# EAGLE design OBDShield_1_1+ (EAGLE 7.1.0)
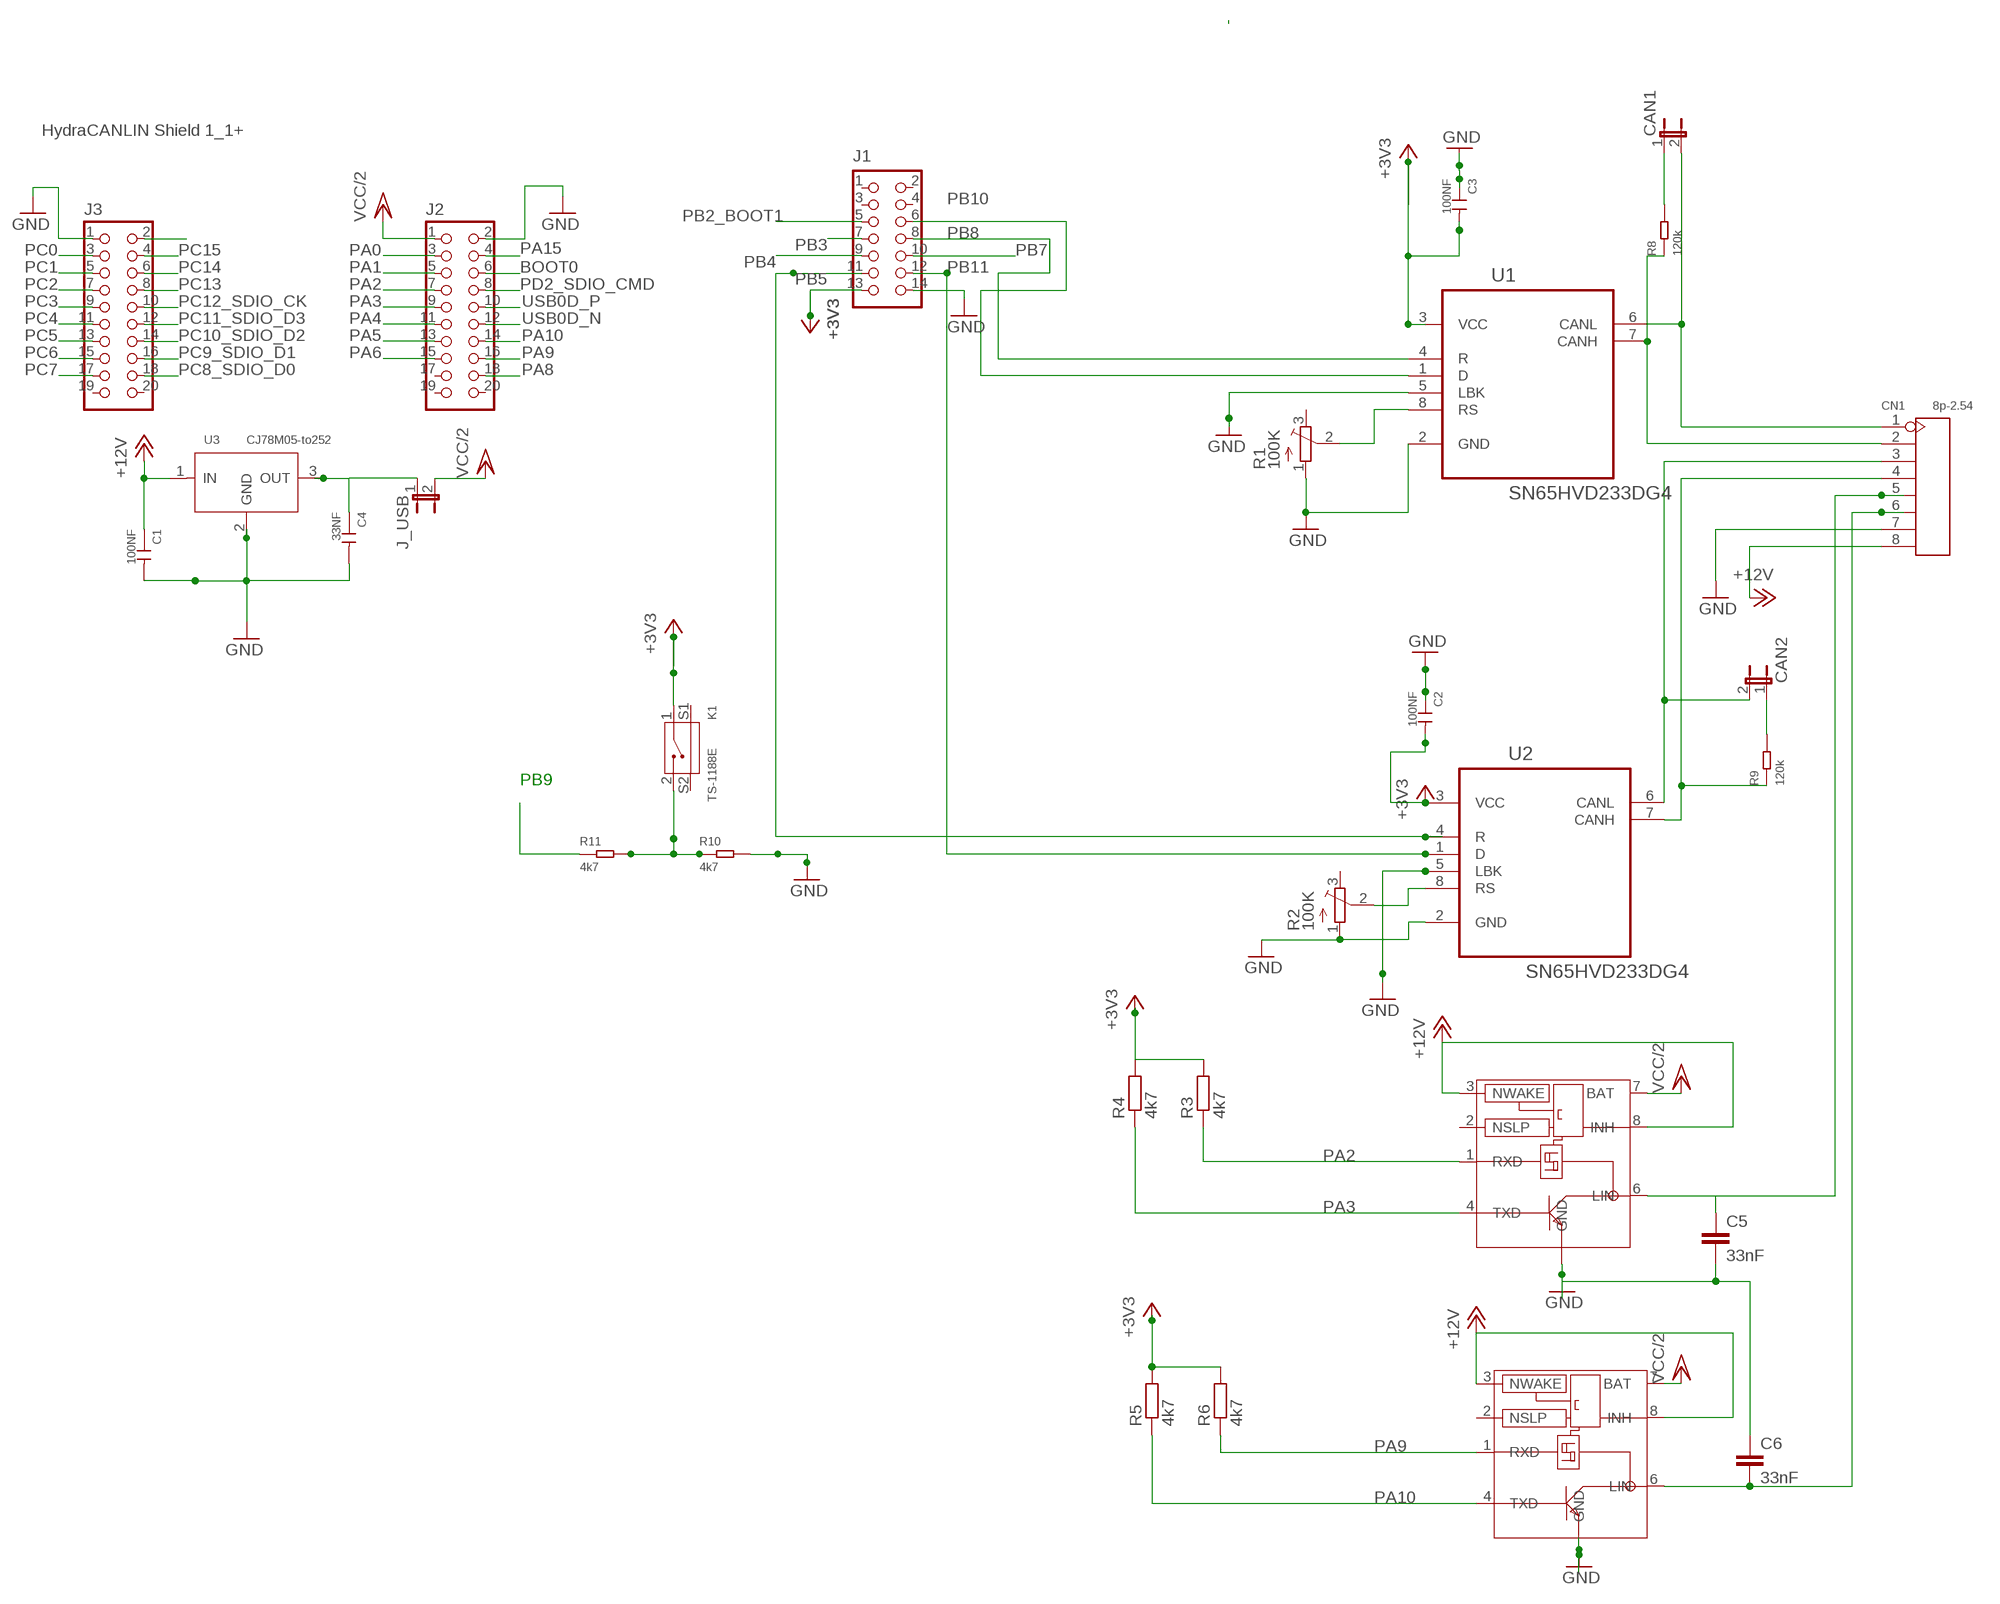
[diagram p0: schematic, sheet 1]

## Parts
C1  100NF  CERAMIC-100NF-50V-20%-Y5V(0805)  [C0805]
C2  100NF  CERAMIC-100NF-50V-20%-Y5V(0805)  [C0805]
C3  100NF  CERAMIC-100NF-50V-20%-Y5V(0805)  [C0805]
C4  33NF  CERAMIC-100NF-50V-20%-Y5V(0805)  [C0805]
C5  33nF  CAP1206  [1206]
C6  33nF  CAP1206  [1206]
CAN1  JP1E  [JP1]
CAN2  JP1E  [JP1]
CN1  8p-2.54  DIP-BLACK-FEMALE-HEADER-VERT(8P-2.54)  [H8-2.54]
J1  HYDRABUS_SHIELD_CON_HEADER_2X07  [HYDRABUS_SHIELD_M2X7]
J2  HYDRABUS_SHIELD_CON_HEADER_2X10  [HYDRABUS_SHIELD_M2X10]
J3  HYDRABUS_SHIELD_CON_HEADER_2X10  [HYDRABUS_SHIELD_M2X10]
J_USB  JP1E  [JP1]
K1  TS-1188E  SMD-BUTTON-2+2P  [SW4-SMD-7.0X3.5X3.5MM-90D]
LIN1  TJA1020SO8  [SO8]
LIN2  TJA1020SO8  [SO8]
R1  100K  TRIM_EU-SM-42/43A  [SM-42/43A]
R2  100K  TRIM_EU-SM-42/43A  [SM-42/43A]
R3  4k7  R-EU_M1206  [M1206]
R4  4k7  R-EU_M1206  [M1206]
R5  4k7  R-EU_M1206  [M1206]
R6  4k7  R-EU_M1206  [M1206]
R8  120k  SMD-RES-33K-1%-1/4W(1206)  [R1206]
R9  120k  SMD-RES-33K-1%-1/4W(1206)  [R1206]
R10  4k7  SMD-RES-33K-1%-1/4W(1206)  [R1206]
R11  4k7  SMD-RES-33K-1%-1/4W(1206)  [R1206]
U1  SN65HVD233DG4  [SOIC127P600X175-8N]
U2  SN65HVD233DG4  [SOIC127P600X175-8N]
U3  CJ78M05-to252  PMIC-CJ78M05(TO-252)  [TO-252]

## Nets
+3V3 [VDD]: C2.2 C3.2 J1.13 K1.1 R3.2 R4.2 R5.2 R6.2 U1.3(VCC) U2.3(VCC)
+12V [VDD]: C1.1 CN1.8 LIN1.3(NWAKE) LIN1.8(INH) LIN2.3(NWAKE) LIN2.8(INH) U3.1(IN)
BOOT0: J2.6
GND [VDD]: C1.2 C2.1 C3.1 C4.2 C5.2 C6.1 CN1.7 J1.14 J2.2 J3.1 LIN1.5(GND) LIN2.5(GND) R1.1(A) R2.1(A) R10.2 U1.2(GND) U1.5(LBK) U2.2(GND) U2.5(LBK) U3.2(GND)
N$1: R1.2(S) U1.8(RS)
N$4: C5.1 CN1.5 LIN2.6(LIN)
N$7: C6.2 CN1.6 LIN1.6(LIN)
N$9: CAN1.2 CN1.1 U1.6(CANL)
N$10: CN1.2 R8.1 U1.7(CANH)
N$11: CAN2.2 CN1.3 U2.6(CANL)
N$12: CN1.4 R9.1 U2.7(CANH)
N$15 [VDD]: C4.1 J_USB.1 U3.3(OUT)
N$16: CAN2.1 R9.2
N$17: R2.2(S) U2.8(RS)
N$19: CAN1.1 R8.2
N$21: K1.2 R10.1 R11.2
N$22 [POWER]: J3.2
PA0: J2.3
PA1: J2.5
PA2: J2.7 LIN2.1(RXD) R3.1
PA3: J2.9 LIN2.4(TXD) R4.1
PA4: J2.11
PA5: J2.13
PA6: J2.15
PA8: J2.18
PA9: J2.16 LIN1.1(RXD) R6.1
PA10: J2.14 LIN1.4(TXD) R5.1
PA15: J2.4
PB2_BOOT1: J1.5
PB3: J1.7
PB4: J1.9
PB5: J1.11 U2.4(R)
PB7: J1.10 R11.1
PB8: J1.8 U1.4(R)
PB10: J1.6 U1.1(D)
PB11: J1.12 U2.1(D)
PC0: J3.3
PC1: J3.5
PC2: J3.7
PC3: J3.9
PC4: J3.11
PC5: J3.13
PC6: J3.15
PC7: J3.17
PC8_SDIO_D0: J3.18
PC9_SDIO_D1: J3.16
PC10_SDIO_D2: J3.14
PC11_SDIO_D3: J3.12
PC12_SDIO_CK: J3.10
PC13: J3.8
PC14: J3.6
PC15: J3.4
PD2_SDIO_CMD: J2.8
USB0D_N: J2.12
USB0D_P: J2.10
VCC/2 [VDD]: J2.1 J_USB.2 LIN1.7(BAT) LIN2.7(BAT)
Unconnected: J1.1 J1.2 J1.3 J1.4 J2.17 J2.19 J2.20 J3.19 J3.20 K1.S1 K1.S2 LIN1.2(NSLP) LIN2.2(NSLP) R1.3(E) R2.3(E)

## Notes on the sheet
- HydraCANLIN Shield 1_1+
- PB9

## Library data of the parts
C1-C3 = Seeed-OPL-Capacitor:CERAMIC-100NF-50V-20%-Y5V(0805): 302010145
C4 = Seeed-OPL-Capacitor:CERAMIC-100NF-50V-20%-Y5V(0805): 302010145; VALUE: 100NF
C5 C6 = _c2h:CAP: Capacitor Standard 0603 ceramic capacitor, and 0.1" leaded capacitor.
CAN1 CAN2 J_USB = jumper:JP1E: JUMPER
CN1 = Seeed-OPL-Connector:DIP-BLACK-FEMALE-HEADER-VERT(8P-2.54): 320030061; MPN: F185-1108A1BSYC1
J1 = hydrabus_shield:HYDRABUS_SHIELD_CON_HEADER_2X07: 2x7 Pin header
J2 J3 = hydrabus_shield:HYDRABUS_SHIELD_CON_HEADER_2X10: 2x10 Pin header
K1 = Seeed-OPL-Button:SMD-BUTTON-2+2P: 311020023; MPN: TS-1188E
LIN1 LIN2 = nxp:TJA1020: Lin Transiver Vbat 5...27Volt 3,3Volt support no extra supply needed ->www.lin-subbus.org ->www.semiconductor.philips.com/pip/tja1020t
R1 R2 = pot:TRIM_EU-: POTENTIOMETER
R3-R6 = resistor:R-EU_: RESISTOR, European symbol
R8-R11 = Seeed-OPL-Resistor:SMD-RES-33K-1%-1/4W(1206): 301010725; MPN: RC1206FR-0733KL; VALUE: 33k
U1 U2 = Texas Instruments_By_element14_Batch_1:SN65HVD233DG4: CAN TRANSCEIVERS; MPN: SN65HVD233DG4; OC_FARNELL: 1207268; OC_NEWARK: 16M2304; PACKAGE: SOIC-8; SUPPLIER: TI
U3 = Seeed-OPL-ic:PMIC-CJ78M05(TO-252): 310030100; MPN: CJ78M05

## Net classes
0 default: width 0.254 mm, drill 0.33 mm, clearance 0.203 mm
1 POWER: width 0.254 mm, drill 0.33 mm, clearance 0.203 mm
2 VDD: width 0.33 mm, drill 0.33 mm, clearance 0.203 mm

## Board
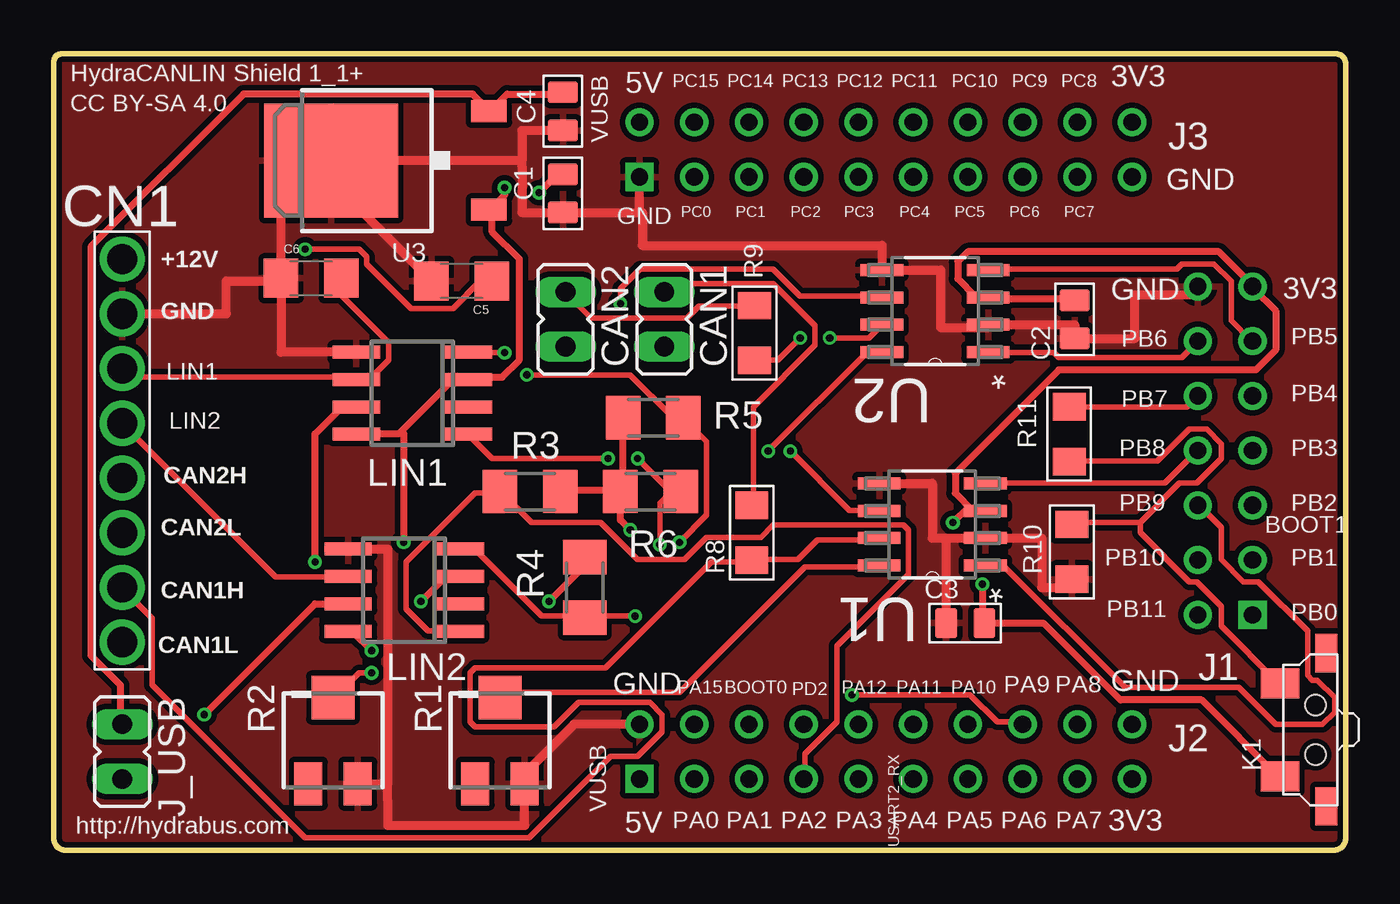
[diagram p1: board, top side]
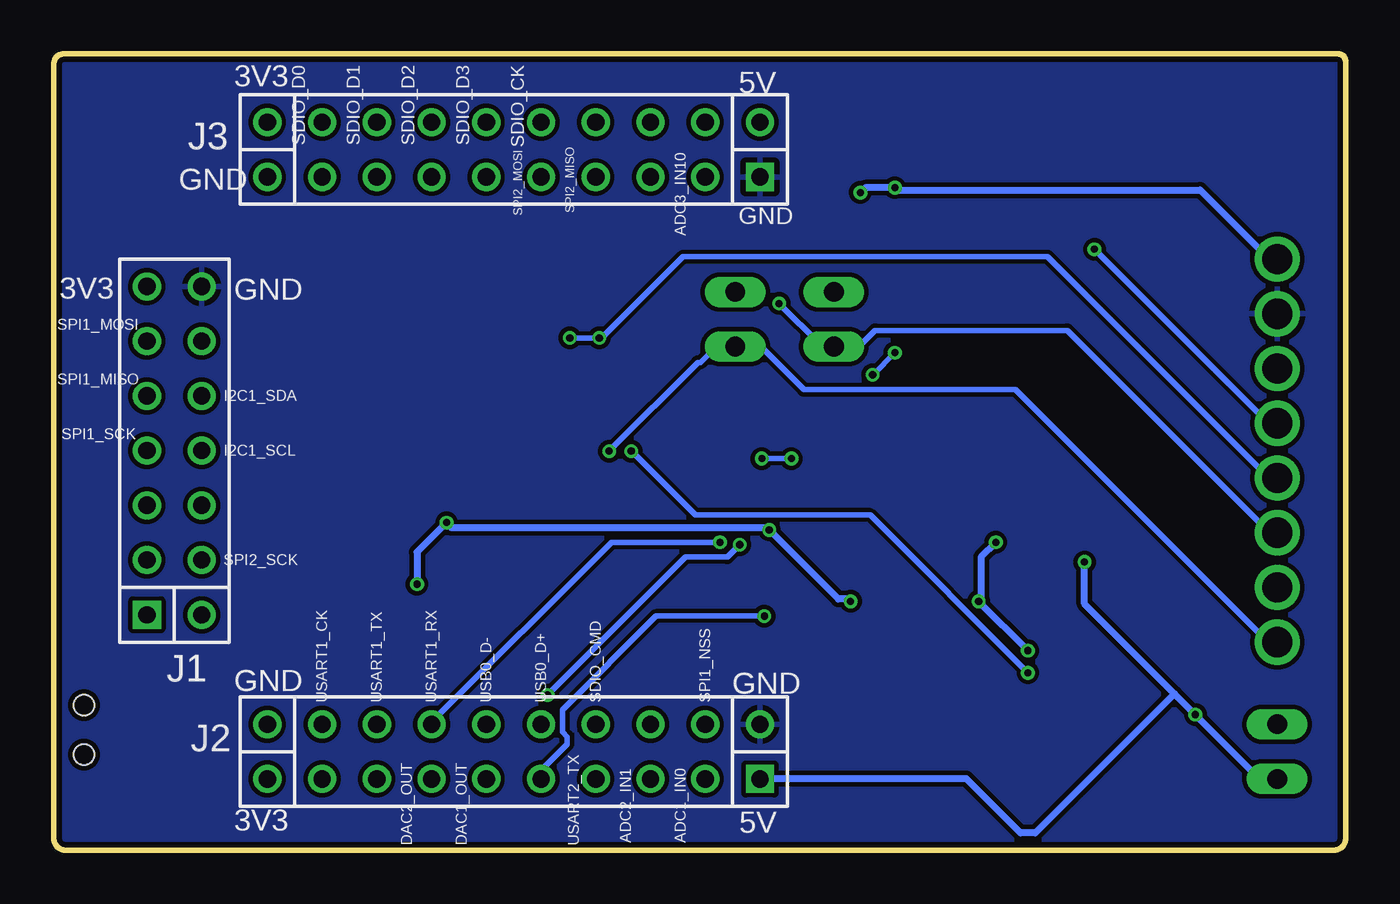
[diagram p2: board, bottom side, seen from below]

Size 59.94 x 36.96 mm. Coordinates in mm from the lower left corner, seen from the top.
Outline: 59.41,0 0.52,0 arc-90 0,0.52 0,36.6 arc-90 0.36,36.96 59.49,36.96 arc-90 59.94,36.5 59.94,0.54 arc-90 59.41,0
Copper layers (1*16): Top 0.035mm / dielectric 1.5mm / Bottom 0.035mm
Design rules "SeeedStudio_2layer_DRU_no_angle_20140221": minimum track width 6mil, minimum drill 12mil, track to track 6mil, track to pad 6mil, pad to pad 6mil, via to via 6mil, smd to smd 0mil, copper to edge 10mil, drill to drill 10mil, minimum pad ring 10mil, minimum via ring 6mil, stop-mask expansion 2mil, vias tented up to drill 100mil, thermal gap 10mil

### Footprints (pad centres in the part's own frame; a part is rotated, then mirrored left to right if it is on the bottom)
C0805 = smd 1.397 x 1.016: 1 0,0.889; 2 0,-0.889
1206 = smd 1.6 x 1.8: 1 -1.4,0; 2 1.4,0
JP1 = drill 0.914 long: 1 0,-1.27; 2 0,1.27
H8-2.54 = drill 1.4 pad 1.93: 1 0,8.89; 2 0,6.35; 3 0,3.81; 4 0,1.27; 5 0,-1.27; 6 0,-3.81; 7 0,-6.35; 8 0,-8.89
HYDRABUS_SHIELD_M2X7 = drill 0.8 square: 1 -7.62,-1.27 | drill 0.8: 2 -7.62,1.27; 3 -5.08,-1.27; 4 -5.08,1.27; 5 -2.54,-1.27; 6 -2.54,1.27; 7 0,-1.27; 8 0,1.27; 9 2.54,-1.27; 10 2.54,1.27; 11 5.08,-1.27; 12 5.08,1.27; 13 7.62,-1.27; 14 7.62,1.27
HYDRABUS_SHIELD_M2X10 = drill 0.8 square: 1 -11.43,-1.27 | drill 0.8: 2 -11.43,1.27; 3 -8.89,-1.27; 4 -8.89,1.27; 5 -6.35,-1.27; 6 -6.35,1.27; 7 -3.81,-1.27; 8 -3.81,1.27; 9 -1.27,-1.27; 10 -1.27,1.27; 11 1.27,-1.27; 12 1.27,1.27; 13 3.81,-1.27; 14 3.81,1.27; 15 6.35,-1.27; 16 6.35,1.27; 17 8.89,-1.27; 18 8.89,1.27; 19 11.43,-1.27; 20 11.43,1.27
SW4-SMD-7.0X3.5X3.5MM-90D = smd 1.397 x 1.778: 1 -2.159,1.651; 2 2.159,1.651 | smd 1.778 x 1.016: S1 -3.556,-0.508; S2 3.556,-0.508 | hole 0.95: -1.15,0; 1.15,0
SO8 = smd 0.6 x 2.2: 1 -1.905,-2.6; 2 -0.635,-2.6; 3 0.635,-2.6; 4 1.905,-2.6; 5 1.905,2.6; 6 0.635,2.6; 7 -0.635,2.6; 8 -1.905,2.6
SM-42/43A = smd 2 x 1.3: 1 2,1.15; 3 2,-1.15 | smd 2 x 2: 2 -2,0
M1206 = smd 1.6 x 2: 1 -1.4,0; 2 1.4,0
R1206 = smd 1.27 x 1.524: 1 -1.27,0; 2 1.27,0
SOIC127P600X175-8N = smd 1.981 x 0.559: 1 -2.464,1.905; 2 -2.464,0.635; 3 -2.464,-0.635; 4 -2.464,-1.905; 5 2.464,-1.905; 6 2.464,-0.635; 7 2.464,0.635; 8 2.464,1.905
TO-252 = smd 1.016 x 1.651: 1 -2.286,-4.826; 3 2.286,-4.826 | smd 5.3 x 6.2: 2 0,2.5

### Placement (x,y rotation side)
C1  23.62,30.48 0 top
C2  47.37,24.64 180 top
C3  42.29,10.54 90 top
C4  23.62,34.29 0 top
C5  18.92,26.42 180 top
C6  11.94,26.54 0 top
CAN1  28.32,24.64 180 top
CAN2  23.75,24.64 180 top
CN1  3.17,18.54 180 top
J1  54.36,18.54 90 top
J2  38.61,4.57 0 top
J3  38.61,32.51 0 top
J_USB  3.17,4.57 180 top
K1  58.55,5.59 90 top
LIN1  16.64,21.21 90 top
LIN2  16.26,12.06 90 top
R1  20.7,5.08 270 top
R2  12.95,5.08 270 top
R3  22.1,16.64 0 top
R4  24.64,12.19 90 top
R5  27.81,20.07 180 top
R6  27.69,16.64 180 top
R8  32.38,14.73 90 top
R9  32.51,24 90 top
R10  47.24,13.84 270 top
R11  47.12,19.3 270 top
U1  40.77,15.11 180 top
U2  40.89,25.02 180 top
U3  15.37,32 90 top

### Tracks (layer width: path | path; a pad name or v marks a point on that pad's centre or on a via)
+3V3  (via drill 0.33)
  Top 0.33: R3.2 23.55,16.69 26.18,16.69 R6.2 | R5.2 26.4,20 26.4,16.69 R6.2 | v22.97,11.54 24.57,13.14 24.57,13.49 R4.2 | v26.75,14.86 26.29,15.32 26.29,16.46 R6.2 | K1.1 56.81,3.43 53.26,6.97 49.49,6.97 45.95,10.52 43.2,10.52 C3.2 43.09,10.63 v43.09,12.34 | C2.2 47.32,25.6 43.43,25.6 U2.3 43.2,25.72 42.75,25.72 41.95,26.52 41.95,27.32 42.41,27.77 54.06,27.77 55.55,26.29 J1.13 55.66,26.06 56.69,25.03 56.69,23.2 55.78,22.29 46.63,22.29 41.83,17.49 41.83,16.57 42.63,15.77 43.2,15.77 U1.3 42.41,15.89 v41.72,15.2
  Bottom 0.33: v22.97,11.54 23.09,11.66 23.55,11.66 v26.75,14.86 26.86,14.97 41.49,14.97 v41.72,15.2 43.09,13.83 v43.09,12.34
+12V  (via drill 0.33)
  Top 0.33: v14.74,9.26 13.95,10.06 13.72,10.06 LIN2.8 | v17.03,11.54 18.17,12.69 18.75,12.69 LIN2.3 | v22.52,30.52 23.32,31.32 23.55,31.32 C1.1 | v20.92,30.75 20.92,30.4 20.23,29.72 U3.1 20.34,29.6 20.34,28.69 21.6,27.43 21.6,22.75 20.8,21.95 19.32,21.95 LIN1.3 19.2,21.83 18.52,21.83 16.12,19.43 | 16.12,19.43 16,19.32 14.06,19.32 LIN1.8 | v16.23,14.29 16.23,19.32 16.12,19.43
  Bottom 0.33: v14.74,9.26 v17.03,11.54 16.92,11.66 16.92,13.6 v16.23,14.29 | v22.52,30.52 22.29,30.75 v20.92,30.75 20.8,30.63 6.74,30.63 3.54,27.43 CN1.8
GND
  Top 0.406: LIN1.5 10.54,23.11 C6.1 | C6.1 10.54,30.61 11.68,30.61 | 11.68,30.61 12.87,30.61 12.87,31.07 | U3.2 12.87,31.5 12.87,31.07 | J2.2 24.13,5.84 21.97,3.68 21.85,3.68 R1.1 21.85,1.14 15.49,1.14 15.49,2.29 15.49,3.08 | R2.1 15.49,3.08 | U1.5 40.77,17.02 40.77,14.48 41.4,14.48 | 41.4,14.48 U1.2 45.85,14.48 45.85,12.19 47.24,12.19 R10.2 | 41.4,14.48 C3.1 | J1.14 53.09,25.78 50.16,25.78 50.16,23.75 C2.1 47.37,24.38 U2.2 43.36,24.26 41.15,24.26 41.15,26.92 U2.5 38.43,28.07 27.3,28.07 27.3,29.59 27.18,29.59 | LIN2.5 15.49,13.97 15.49,3.08 | CN1.7 8,24.89 8,26.42 10.54,26.42 C6.1 | C5.2 12.87,31.07 | 21.72,32 21.72,31.75 21.72,29.59 C1.2 27.18,29.59 | 21.72,32 11.68,32 11.68,30.61 | C4.2 21.72,33.4 21.72,32 | 27.18,29.59 J3.1
  pour Top (isolate 0.254): -1,38.22 60.84,38.22 60.84,-1 -1,-1
  pour Bottom (isolate 0.203): -2.02,39.86 62.13,39.86 62,-2 -2,-2
N$1
  Top 0.254: U1.8 38.29,13.14 34.86,13.14 29.03,7.32 21.03,7.32 20.8,7.09 R1.2
N$4  (via drill 0.33)
  Top 0.254: v11.66,27.89 14.17,27.89 14.52,27.55 14.52,27.2 16.57,25.15 18.52,25.15 19.77,26.4 20.23,26.4 C5.1 | LIN2.6 13.6,12.69 10.29,12.69 3.2,19.77 CN1.5
  Bottom 0.254: v11.66,27.89 3.66,19.89 3.2,19.89 CN1.5
N$7
  Top 0.254: C6.2 13.37,26.52 13.37,25.72 15.54,23.55 15.54,22.75 14.74,21.95 14.06,21.95 LIN1.6 13.95,21.95 3.54,21.95 3.2,22.29 CN1.6
N$9  (via drill 0.33)
  Top 0.254: v34.18,18.52 36.92,15.77 38.29,15.77 U1.6
  Bottom 0.254: v34.18,18.52 30.06,22.63 29.95,22.63 29.26,23.32 28.35,23.32 CAN1.2 28.23,23.32 27.09,23.32 25.15,21.37 15.32,21.37 3.66,9.72 3.2,9.72 CN1.1
N$10
  Top 0.254: U1.7 38.29,14.4 35.43,14.4 34.52,13.49 32.46,13.49 R8.1 32.35,13.37 30.52,13.37 25.6,8.46 19.55,8.46 19.32,8.23 19.32,5.94 19.55,5.71 23.2,5.71 24.35,6.86 27.66,6.86 28.23,6.29 28.23,5.49 27.09,4.34 25.83,4.34 22.06,0.57 11.66,0.57 4.57,7.66 4.57,10.74 3.2,12.12 CN1.2
N$11  (via drill 0.33)
  Top 0.254: v26.29,25.38 26.29,26.06 27.2,26.98 33.38,26.98 34.63,25.72 38.41,25.72 U2.6
  Bottom 0.254: v26.29,25.38 24.35,23.43 23.77,23.43 CAN2.2 23.66,23.43 22.52,23.43 21.83,24.12 12.92,24.12 3.54,14.74 3.2,14.74 CN1.3
N$12  (via drill 0.33)
  Top 0.254: v34.63,23.77 33.6,22.75 32.58,22.75 R9.1 | v36.01,23.77 37.83,23.77 38.41,24.35 U2.7
  Bottom 0.254: v36.01,23.77 v34.63,23.77 34.52,23.77 30.75,27.55 13.83,27.55 3.66,17.37 3.2,17.37 CN1.4
N$15
  Top 0.33: C4.1 23.55,35.09 21.03,35.09 20.23,34.29 U3.3 20.12,34.4 19.43,35.09 8.8,35.09 1.71,28 1.71,9.03 3.09,7.66 3.09,5.94 J_USB.1
N$16
  Top 0.254: R9.2 32.46,25.26 29.95,25.26 29.38,24.69 24.92,24.69 23.77,25.83 CAN2.1
N$17  (via drill 0.33)
  Top 0.254: v33.15,18.52 37.72,23.09 38.41,23.09 U2.8 | v14.74,8.23 14.17,8.23 13.03,7.09 R2.2
  Bottom 0.254: v33.15,18.52 30.18,15.54 22.06,15.54 v14.74,8.23
N$19
  Top 0.254: R8.2 32.46,16 32.46,20.57 35.32,23.43 35.32,24.35 33.38,26.29 28.69,26.29 28.35,25.95 CAN1.1
N$21
  Top 0.254: 50.41,15.2 52.23,17.03 53.03,17.03 54.18,18.17 54.18,18.86 53.49,19.55 52.69,19.55 51.21,18.06 47.21,18.06 R11.2 | 50.41,15.2 47.32,15.2 R10.1 | 50.41,15.2 50.41,14.74 52.69,12.46 53.03,12.46 54.18,11.32 54.18,10.4 56.81,7.77 K1.2
PA2
  Top 0.254: LIN2.1 18.75,10.17 17.37,10.17 16.34,11.2 16.34,13.37 19.55,16.57 20.69,16.57 R3.1 20.8,16.57 22.17,15.2 25.38,15.2 27.09,13.49 29.26,13.49 30.29,14.52 32.8,14.52 33.38,15.09 39.43,15.09 39.66,14.86 39.66,12.8 36.35,9.49 36.35,5.94 34.86,4.46 34.86,3.31 J2.7
PA3  (via drill 0.33)
  Top 0.254: LIN2.4 18.86,13.95 19.55,13.95 22.63,10.86 24.57,10.86 R4.1 24.69,10.86 v26.98,10.86
  Bottom 0.254: v26.98,10.86 32,10.86 36.35,6.51 36.35,5.49 36.12,5.26 36.12,4.92 37.26,3.77 37.26,3.31 J2.9
PA9  (via drill 0.33)
  Top 0.254: v27.09,18.17 28.57,16.69 29.03,16.69 R6.1 28.57,16.57 28.12,16.12 v28.12,14.17 | v25.72,18.17 20.34,18.17 19.32,19.2 LIN1.1 | v37.03,7.2 42.52,7.2 43.78,5.94 44.92,5.94 J2.16
  Bottom 0.254: v25.72,18.17 v27.09,18.17 | v37.03,7.2 30.63,13.6 28.69,13.6 v28.12,14.17
PA10  (via drill 0.33)
  Top 0.254: v21.95,22.06 26.75,22.06 28.69,20.12 29.15,20.12 R5.1 29.26,20 30.29,18.97 30.29,15.54 v29.03,14.29 | v20.92,23.09 19.32,23.09 LIN1.4
  Bottom 0.254: v20.92,23.09 v21.95,22.06 | v29.03,14.29 34.06,14.29 42.41,5.94 J2.14
PB5
  Top 0.254: U2.4 43.43,26.98 52.12,26.98 52.35,27.2 53.84,27.2 54.63,26.4 54.63,24.57 55.55,23.66 J1.11
PB7
  Top 0.254: R11.1 52.58,20.57 J1.10
PB8
  Top 0.254: U1.4 43.32,17.03 51.55,17.03 53.03,18.52 J1.8
PB10
  Top 0.254: U1.1 43.32,13.14 44.12,13.14 49.72,7.54 54.98,7.54 56.69,5.83 58.86,5.83 59.44,6.4 59.44,7.09 58.64,7.89 58.41,7.89 58.18,8.12 58.18,10.17 55.89,12.46 55.21,12.46 54.18,13.49 54.18,14.97 53.15,16 J1.6
PB11
  Top 0.254: U2.1 43.43,23.09 46.41,23.09 46.63,22.86 52.35,22.86 53.03,23.55 J1.12
VCC/2  (via drill 0.33)
  Top 0.33: LIN2.7 12.12,11.43 v6.97,6.29 | LIN1.7 13.37,20.57 12.12,19.32 v12.12,13.37
  Bottom 0.33: J_USB.2 3.2,3.31 4,3.31 v6.97,6.29 7.94,7.26 | v12.12,13.37 12.12,11.43 7.94,7.26 | 7.94,7.26 14.4,0.8 15.09,0.8 17.6,3.31 27.09,3.31 J2.1

### Text on the board
tPlace: +12V | GND | LIN1 | LIN2 | CAN2H | CAN2L | CAN1H | CAN1L
tNames: HydraCANLIN Shield 1_1+ | 5V | PC15 | PC14 | PC13 | PC12 | PC11 | PC10 | PC9 | PC8 | 3V3 | CC BY-SA 4.0 | VUSB | J3 | GND | GND | PC0 | PC1 | PC2 | PC3 | PC4 | PC5 | PC6 | PC7 | GND | 3V3 | PB6 | PB5 | PB7 | PB4 | PB8 | PB3 | PB9 | PB2 | BOOT1 | PB10 | PB1 | PB11 | PB0 | PA15 | BOOT0 | PD2 | PA12 | PA11 | PA10 | PA9 | PA8 | J1 | GND | GND | J2 | USART2_RX | VUSB | http://hydrabus.com | 5V | PA0 | PA1 | PA2 | PA3 | PA4 | PA5 | PA6 | PA7 | 3V3
bNames: SDIO_CK | SDIO_D3 | SDIO_D2 | SDIO_D1 | SDIO_D0 | 5V | 3V3 | SPI2_MISO | SPI2_MOSI | ADC3_IN10 | GND | GND | GND | 3V3 | SPI1_MOSI | SPI1_MISO | I2C1_SDA | SPI1_SCK | I2C1_SCL | SPI2_SCK | GND | SPI1_NSS | SDIO_CMD | USB0_D+ | USB0_D- | USART1_RX | USART1_TX | USART1_CK | GND | ADC1_IN0 | ADC2_IN1 | USART2_TX | DAC1_OUT | DAC2_OUT | 5V | 3V3